# EAGLE design LMeterShield_Rev1 (EAGLE 7.1.0)
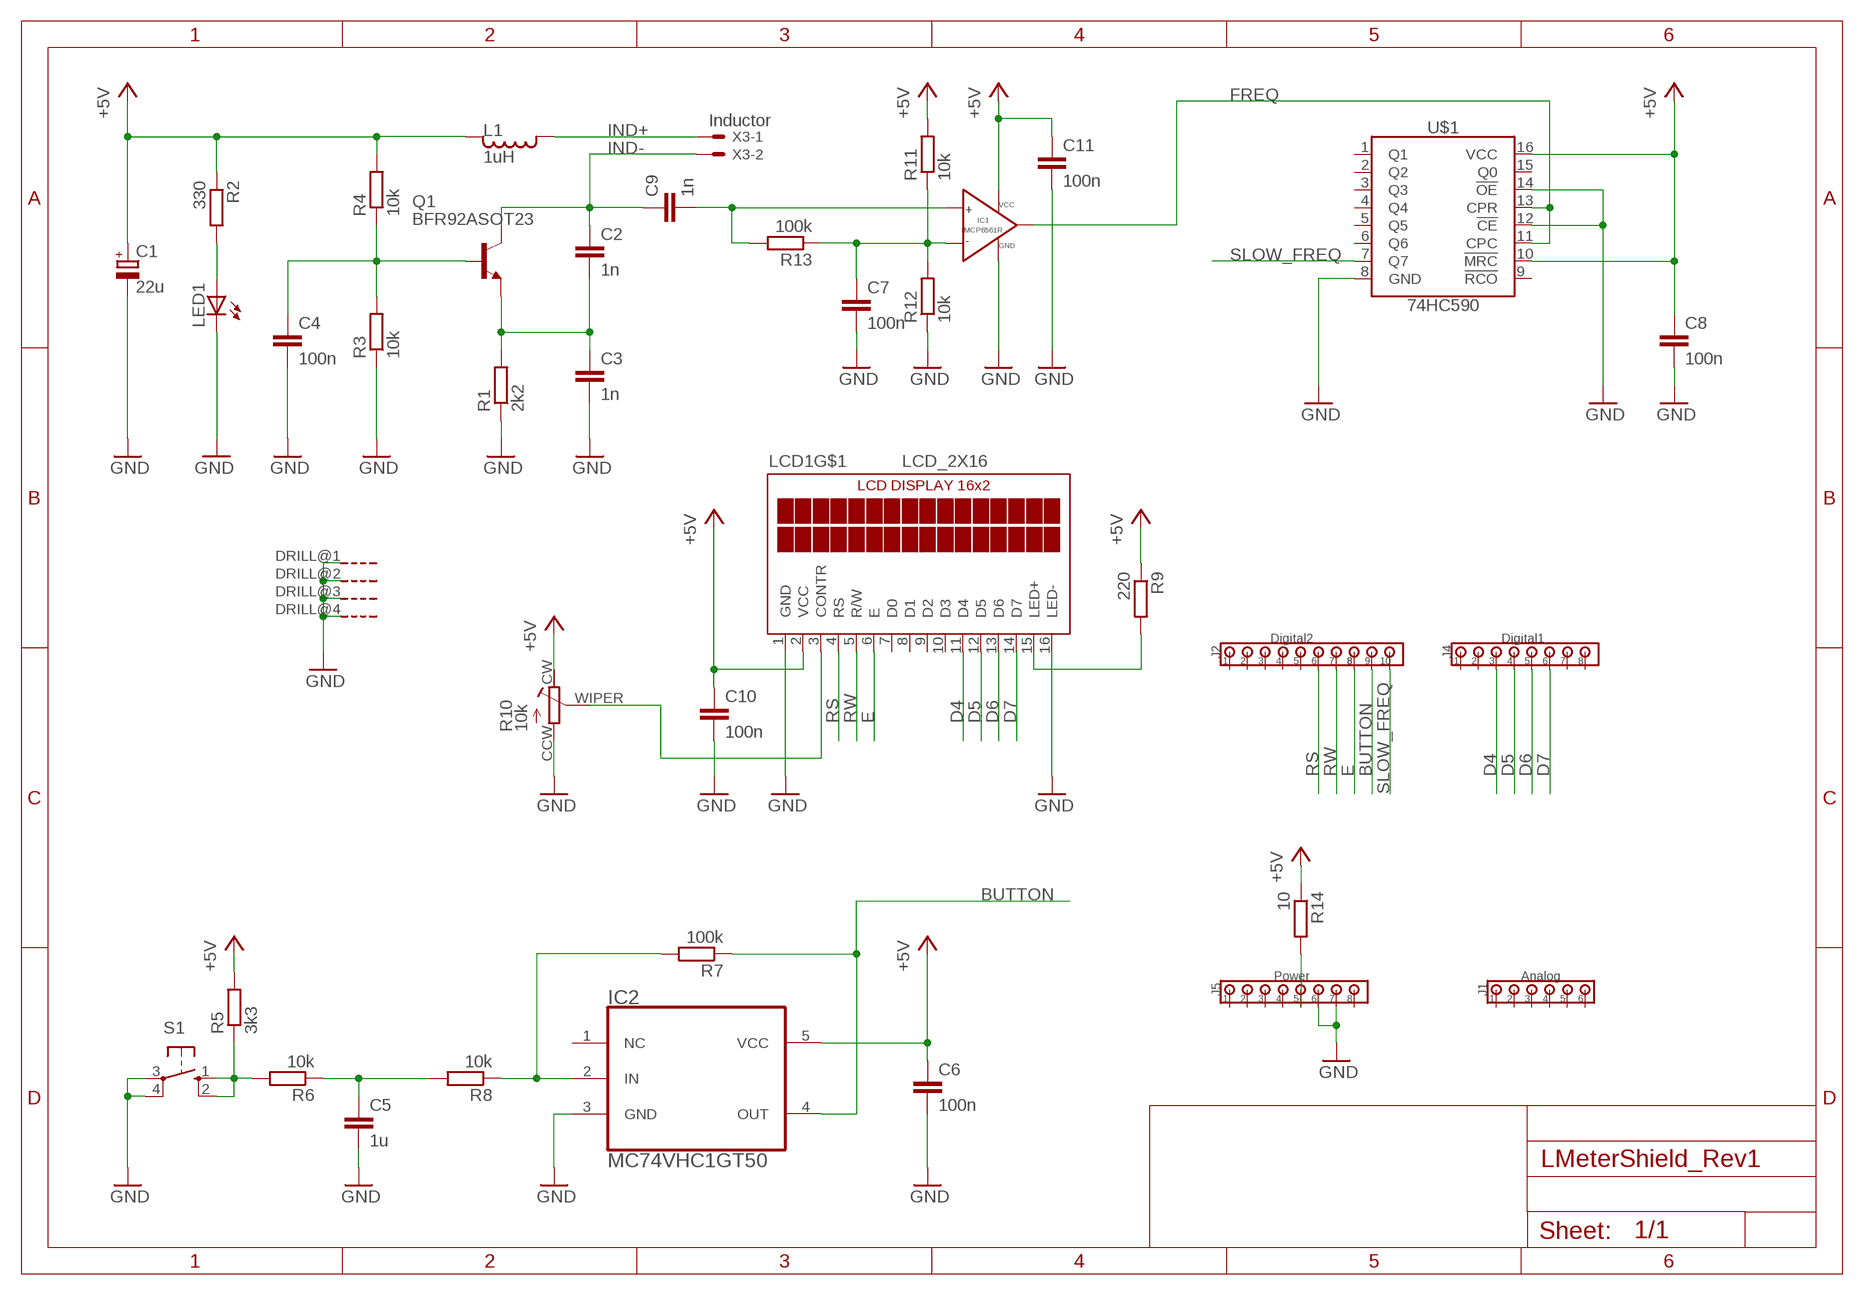
[diagram p0: schematic, sheet 1]

## Parts
C1  22u  C_POLARIZEDSMC_C  [SMC_C]
C2  1n  CC0805  [C0805]
C3  1n  CC0805  [C0805]
C4  100n  CC0805  [C0805]
C5  1u  CC0805  [C0805]
C6  100n  CC0805  [C0805]
C7  100n  CC0805  [C0805]
C8  100n  CC0805  [C0805]
C9  1n  CC0805  [C0805]
C10  100n  CC0805  [C0805]
C11  100n  CC0805  [C0805]
IC1  MCP6561R  [SOT-23-5]
IC2  MC74VHC1GT50  [SOT-23-5]
J1  Analog  100MIL_6X  [100MIL_6X_ROUND]
J2  Digital2  100MIL_10X  [100MIL_10X_ROUND]
J4  Digital1  100MIL_8X  [100MIL_8X_ROUND]
J5  Power  100MIL_8X  [100MIL_8X_ROUND]
L1  1uH  INDUCTOR0805  [L0805]
LCD1  LCD_2X16  [LCD_2X16]
LED1  LED0805  [LED0805]
Q1  BFR92ASOT23  [SOT23]
R1  2k2  RESISTORR0805  [R0805]
R2  330  RESISTORR0805  [R0805]
R3  10k  RESISTORR0805  [R0805]
R4  10k  RESISTORR0805  [R0805]
R5  3k3  RESISTORR0805  [R0805]
R6  10k  RESISTORR0805  [R0805]
R7  100k  RESISTORR0805  [R0805]
R8  10k  RESISTORR0805  [R0805]
R9  220  RESISTORR0805  [R0805]
R10  10k  TRIMMER3314G  [RTRIM3314G]
R11  10k  RESISTORR0805  [R0805]
R12  10k  RESISTORR0805  [R0805]
R13  100k  RESISTORR0805  [R0805]
R14  10  RESISTORR0805  [R0805]
S1  10-XX  [B3F-10XX]
U$1  74HC590  [SO16]
X3  Inductor  22-23-2021100MIL  [22-23-2021]

## Nets
+5V: C1.+ C6.1 C8.1 C10.1 C11.1 IC1.2(VCC) IC2.5(VCC) L1.2 LCD1.2(VCC) R2.1 R4.2 R5.2 R9.1 R10.CW R11.2 R14.1 U$1.10(!MRC!) U$1.16(VCC)
BUTTON: IC2.4(OUT) J2.9 R7.1
D4: J4.3 LCD1.11(D4)
D5: J4.4 LCD1.12(D5)
D6: J4.5 LCD1.13(D6)
D7: J4.6 LCD1.14(D7)
E: J2.8 LCD1.6(E)
FREQ: IC1.1(VOUT) U$1.11(CPC) U$1.13(CPR)
GND: C1.- C3.2 C4.2 C5.2 C6.2 C7.2 C8.2 C10.2 C11.2 IC1.5(GND) IC2.3(GND) J5.6 J5.7 LCD1.1(GND) LCD1.16(LED-) LCD1.DRILL@1(G) LCD1.DRILL@2(G) LCD1.DRILL@3(G) LCD1.DRILL@4(G) LED1.C R1.1 R3.1 R10.CCW R12.1 S1.3(P) S1.4(P1) U$1.8(GND) U$1.12(!CE!) U$1.14(!OE!)
IND+: L1.1 X3.1
IND-: C2.1 C9.1 Q1.3(C) X3.2
N$1: LED1.A R2.2
N$3: C2.2 C3.1 Q1.2(E) R1.2
N$4: C4.1 Q1.1(B) R3.2 R4.1
N$6: C5.1 R6.1 R8.2
N$7: R5.1 R6.2 S1.1(S) S1.2(S1)
N$8: IC2.2(IN) R7.2 R8.1
N$9: LCD1.15(LED+) R9.2
N$10: LCD1.3(CONTR) R10.WIPER
N$11: C7.1 IC1.4(VIN-) R11.1 R12.2 R13.1
N$12: C9.2 IC1.3(VIN+) R13.2
RS: J2.6 LCD1.4(RS)
RW: J2.7 LCD1.5(R/W)
SLOW_FREQ: J2.10 U$1.7(Q7)
VIN: J5.5 R14.2
Unconnected: IC2.1(NC) J1.1 J1.2 J1.3 J1.4 J1.5 J1.6 J2.1 J2.2 J2.3 J2.4 J2.5 J4.1 J4.2 J4.7 J4.8 J5.1 J5.2 J5.3 J5.4 J5.8 LCD1.7(D0) LCD1.8(D1) LCD1.9(D2) LCD1.10(D3) U$1.1(Q1) U$1.2(Q2) U$1.3(Q3) U$1.4(Q4) U$1.5(Q5) U$1.6(Q6) U$1.9(!RCO!) U$1.15(Q0)

## Library data of the parts
C1 = 00Capacitor:C_POLARIZED
C2-C11 = 00Capacitor:C: Capacitor
IC1 = 00OpAmp:MCP6561R: 1.8V Low-Power Push-Pull Output Comparator Propagation delay 80ns max
IC2 = 00Logic:MC74VHC1GT50: Non-Inverting Buffer / Level Shifter
J1 = 00Connector:100MIL_6X: 100 mil 6-pin connector
J2 = 00Connector:100MIL_10X: 100mil 10-pin connector
J4 J5 = 00Connector:100MIL_8X: 100 mil 8-pin connector
L1 = 00Inductor:INDUCTOR
LCD1 = 00Display:LCD_2X16
LED1 = 00Display:LED: LED
Q1 = 00Transistor:BFR92A
R1-R9 R11-R14 = 00Resistor:RESISTOR: RESISTOR, European symbol
R10 = 00Resistor:TRIMMER
S1 = 00Switch:10-XX: OMRON SWITCH
U$1 = 00Logic:74HC590: 8-bit binary counter with output register; 3-state
X3 = 00Connector:22-23-2021: .100" (2.54mm) Center Header - 2 Pin; MF: MOLEX; MPN: 22-23-2021; OC_FARNELL: 1462926; OC_NEWARK: 25C3832

## Board
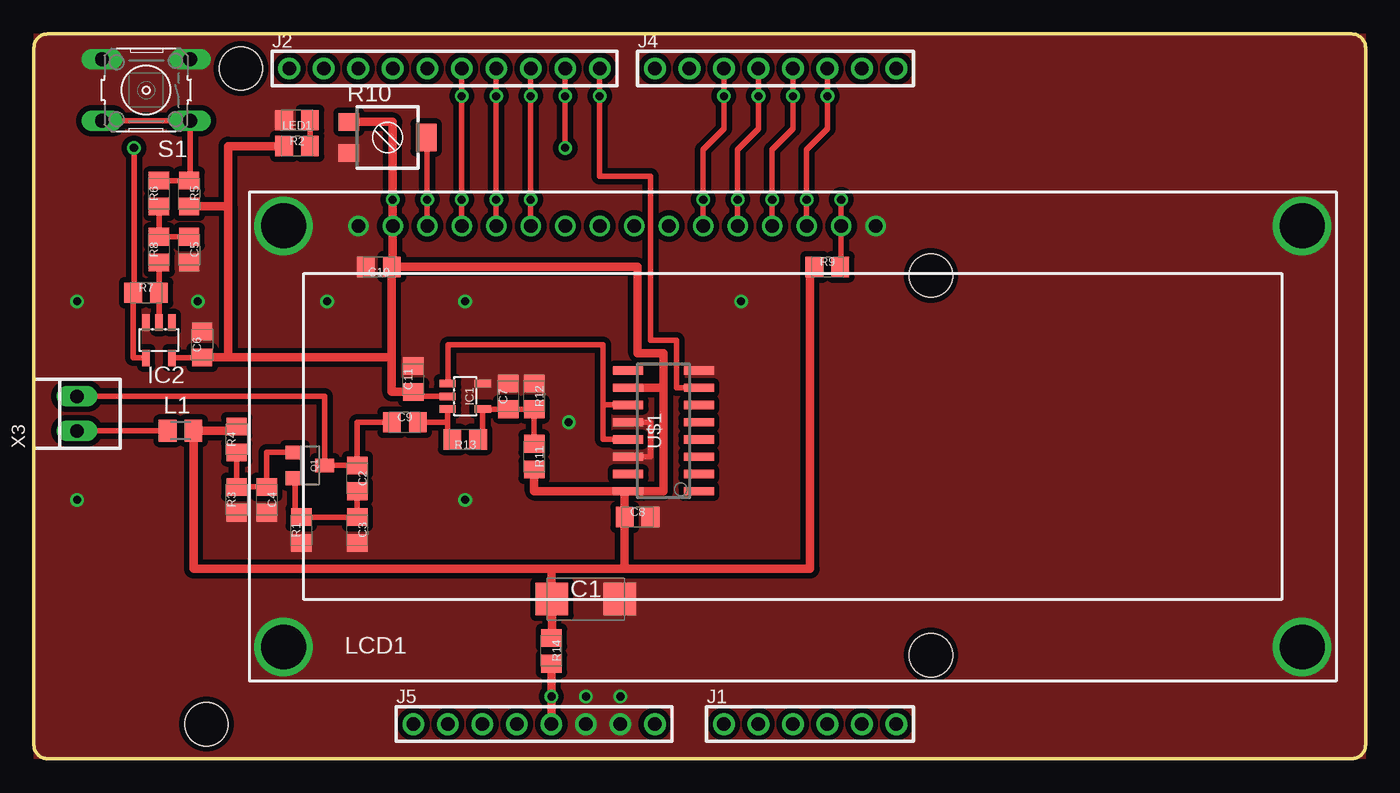
[diagram p1: board, top side]
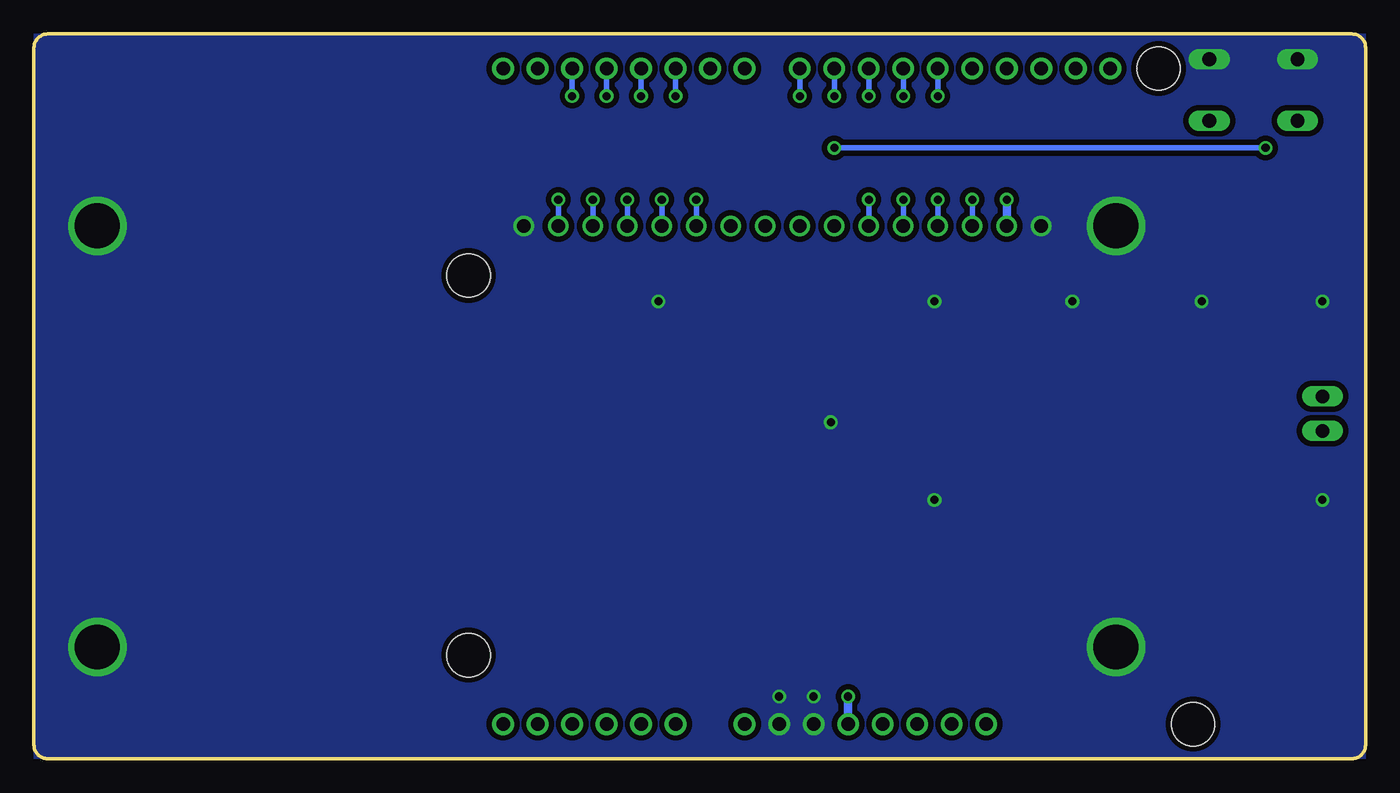
[diagram p2: board, bottom side, seen from below]

Size 98.04 x 53.34 mm. Coordinates in mm from the lower left corner, seen from the top.
Outline: 65.04,0 97.03,0 arc90 98.04,1.02 98.04,52.32 arc90 97.03,53.34 1,53.34 arc90 0,52.34 0,1 arc90 1,0 65.02,0
Outline: 65.02,0 arc-90 65.04,0
Outline: 65.04,0 65.02,0
Copper layers (1*16): Top 0.035mm / dielectric 1.5mm / Bottom 0.035mm
Design rules "default *": minimum track width 10mil, minimum drill 24mil, track to track 8mil, track to pad 8mil, pad to pad 8mil, via to via 8mil, smd to smd 8mil, copper to edge 0mil, drill to drill 8mil, minimum pad ring 10mil, minimum via ring 8mil, stop-mask expansion 4mil, vias tented up to drill 0mil, thermal gap 10mil
Holes 3.2 mm at 15.24,50.8 66.04,7.62 66.04,35.56 12.7,2.54

### Footprints (pad centres in the part's own frame; a part is rotated, then mirrored left to right if it is on the bottom)
SMC_C = smd 2.4 x 2.4: + -2.5,0; - 2.5,0
C0805 = smd 1.3 x 1.5: 1 -0.95,0; 2 0.95,0
SOT-23-5 = smd 0.55 x 1.2: 1 -0.95,-1.3; 2 0,-1.3; 3 0.95,-1.3; 4 0.95,1.3; 5 -0.95,1.3
100MIL_6X_ROUND = drill 1 pad 1.6: 1 -6.35,0; 2 -3.81,0; 3 -1.27,0; 4 1.27,0; 5 3.81,0; 6 6.35,0
100MIL_10X_ROUND = drill 1 pad 1.6: 1 -8.89,0; 2 -6.35,0; 3 -3.81,0; 4 -1.27,0; 5 1.27,0; 6 3.81,0; 7 6.35,0; 8 8.89,0; 9 11.43,0; 10 13.97,0
100MIL_8X_ROUND = drill 1 pad 1.6: 1 -8.89,0; 2 -6.35,0; 3 -3.81,0; 4 -1.27,0; 5 1.27,0; 6 3.81,0; 7 6.35,0; 8 8.89,0
L0805 = smd 1.3 x 1.6: 1 -0.95,0; 2 0.95,0
LCD_2X16 = drill 1: 1 8,33.5; 2 10.54,33.5; 3 13.08,33.5; 4 15.62,33.5; 5 18.16,33.5; 6 20.7,33.5; 7 23.24,33.5; 8 25.78,33.5; 9 28.32,33.5; 10 30.86,33.5; 11 33.4,33.5; 12 35.94,33.5; 13 38.48,33.5; 14 41.02,33.5; 15 43.56,33.5; 16 46.1,33.5 | drill 3.3: DRILL@1 2.5,33.5; DRILL@2 77.5,33.5; DRILL@3 77.5,2.5; DRILL@4 2.5,2.5
LED0805 = smd 1.3 x 1.5: A -0.95,0; C 0.95,0
SOT23 = smd 1 x 1.4: 1 -0.95,-1.1; 2 0.95,-1.1; 3 0,1.1
R0805 = smd 1.3 x 1.5: 1 -0.95,0; 2 0.95,0
RTRIM3314G = smd 1.3 x 1.5: CCW 1.15,-2.85; CW -1.15,-2.85 | smd 2 x 1.5: WIPER 0,2.85
B3F-10XX = drill 1.016 long: 1 -3.251,2.261; 2 3.251,2.261; 3 -3.251,-2.261; 4 3.251,-2.261
SO16 = smd 0.6 x 2.2: 1 -4.445,-2.6; 2 -3.175,-2.6; 3 -1.905,-2.6; 4 -0.635,-2.6; 5 0.635,-2.6; 6 1.905,-2.6; 7 3.175,-2.6; 8 4.445,-2.6; 9 4.445,2.6; 10 3.175,2.6; 11 1.905,2.6; 12 0.635,2.6; 13 -0.635,2.6; 14 -1.905,2.6; 15 -3.175,2.6; 16 -4.445,2.6
22-23-2021 = drill 1 long: 1 -1.27,0; 2 1.27,0

### Placement (x,y rotation side)
C1  40.64,11.75 0 top
C2  23.81,20.64 270 top
C3  23.81,16.83 270 top
C4  17.14,19.05 270 top
C5  11.43,37.47 270 top
C6  12.38,30.48 90 top
C7  34.92,26.67 90 top
C8  44.45,17.78 0 top
C9  27.3,24.77 0 top
C10  25.4,36.2 180 top
C11  27.94,27.94 90 top
IC1  31.75,26.67 270 top
IC2  9.21,30.8 180 top
J1  57.15,2.54 0 top
J2  27.69,50.8 0 top
J4  54.61,50.8 0 top
J5  36.83,2.54 0 top
L1  10.79,24.13 0 top
LCD1  15.88,5.71 0 top
LED1  19.37,46.99 180 top
Q1  20.32,21.59 270 top
R1  19.68,16.83 90 top
R2  19.37,45.09 0 top
R3  14.92,19.05 90 top
R4  14.92,23.5 90 top
R5  11.43,41.59 270 top
R6  9.21,41.59 90 top
R7  8.26,34.29 0 top
R8  9.21,37.47 90 top
R9  58.42,36.2 0 top
R10  26.04,45.72 270 top
R11  36.83,22.23 270 top
R12  36.83,26.67 270 top
R13  31.75,23.5 180 top
R14  38.1,7.94 270 top
S1  8.26,49.21 180 top
U$1  46.35,24.13 90 top
X3  3.17,25.4 90 top

### Tracks (layer width: path | path; a pad name or v marks a point on that pad's centre or on a via)
+5V  (via drill 0.6)
  Top 0.406: IC1.2 28.26,26.67 arc-90 C11.1 | IC2.5 12.03,29.5 C6.1
  Top 0.61: U$1.10 46.35,27.3 | 46.35,27.3 46.35,19.68 U$1.16 | U$1.16 36.83,19.68 R11.2 | R10.CW 26.41,46.87 LCD1.2 26.41,36.2 C10.1 | 43.5,13.97 C8.1 43.5,19.68 U$1.16 | R9.1 57.15,36.2 57.15,13.97 43.5,13.97 | 26.35,29.53 26.35,26.99 C11.1 | 26.35,29.53 C10.1 | R4.2 14.92,24.13 L1.2 11.74,13.97 38.1,13.97 | 38.1,13.97 43.5,13.97 | 46.35,27.3 46.35,29.84 44.45,29.84 44.45,36.2 C10.1 | 12.03,29.5 12.03,29.53 14.29,29.53 | 14.29,29.53 26.35,29.53 | R5.2 14.29,40.64 | 14.29,40.64 14.29,29.53 | R2.1 14.29,45.09 14.29,40.64 | R14.1 38.14,8.57 C1.+ 38.1,11.43 38.1,13.97
  Bottom 0.406: 26.42,39.12 LCD1.2
  Bottom 0.61: v26.42,41.15 26.42,39.12
BUTTON  (via drill 0.6)
  Top 0.406: J2.9 v39.12,48.77 v39.12,44.96 | IC2.4 7.3,29.5 R7.1 7.37,34.8 v7.37,44.96
  Bottom 0.406: v39.12,48.77 J2.9 | v39.12,44.96 v7.37,44.96
D4  (via drill 0.6)
  Top 0.406: J4.3 v50.8,48.77 50.8,46.35 49.27,44.83 LCD1.11
  Bottom 0.406: J4.3 v50.8,48.77 | v49.28,41.15 49.28,39.12 49.27,39.12 LCD1.11
D5  (via drill 0.6)
  Top 0.406: J4.4 v53.34,48.77 53.34,46.35 51.81,44.83 LCD1.12
  Bottom 0.406: v53.34,48.77 J4.4 | v51.82,41.15 51.82,39.12 51.81,39.12 LCD1.12
D6  (via drill 0.6)
  Top 0.406: J4.5 v55.88,48.77 55.88,46.35 54.35,44.83 LCD1.13
  Bottom 0.406: J4.5 v55.88,48.77 | v54.36,41.15 54.36,39.37 | 54.36,39.37 54.36,39.12 | LCD1.13 54.35,39.37 54.36,39.37
D7  (via drill 0.6)
  Top 0.406: J4.6 v58.42,48.77 58.42,46.35 56.9,44.83 LCD1.14
  Bottom 0.406: v58.42,48.77 J4.6 | v56.9,41.15 56.9,39.12 LCD1.14
E  (via drill 0.6)
  Top 0.406: J2.8 arc90 J2.8 LCD1.6
  Bottom 0.406: v36.58,48.77 J2.8 | v36.58,41.15 36.58,39.12 LCD1.6
FREQ
  Top 0.406: U$1.13 41.91,23.5 41.91,26.04 | 41.91,26.04 U$1.11 | IC1.1 30.48,27.62 30.48,30.48 41.91,30.48 41.91,26.04
GND  (via drill 0.6)
  Top 0.406: U$1.12 45.4,24.77 45.4,22.23 43.81,22.23
  other vias: 39.37,24.77 52.07,33.66 31.75,33.66 31.75,19.05 40.64,4.57 43.18,4.57 12.06,33.66 3.17,33.66 21.59,33.66 3.17,19.05
  pour Top (isolate 0.4, no thermals): 0,53.34 98.04,53.34 98.04,0 0,0
  pour Bottom (isolate 0.4, no thermals): 0,53.34 98.04,53.34 98.04,0 0,0
IND+
  Top 0.406: X3.1 L1.1
IND-
  Top 0.406: X3.2 21.42,26.67 Q1.3 C2.1 23.81,24.77 C9.1
N$1
  Top 0.406: R2.2 LED1.A
N$3
  Top 0.406: Q1.2 19.22,17.78 R1.2 C3.1 C2.2
N$4
  Top 0.406: R4.1 R3.2 C4.1 17.14,22.54 Q1.1
N$6
  Top 0.406: R6.1 R8.2 C5.1
N$7
  Top 0.406: R6.2 R5.1 11.51,42.54 S1.1 S1.2
N$8
  Top 0.406: IC2.2 R7.2 R8.1
N$9  (via drill 0.6)
  Top 0.406: LCD1.15 | LCD1.15 v59.44,41.15 | LCD1.15 59.44,36.26 R9.2
  Bottom 0.406: LCD1.15 v59.44,41.15
N$10  (via drill 0.6)
  Top 0.406: LCD1.3 28.95,45.65 R10.WIPER
  Bottom 0.406: v28.96,41.15 28.96,39.12 28.95,39.12 LCD1.3
N$11
  Top 0.406: R11.1 R12.2 C7.1 IC1.4 33.05,23.5 R13.1
N$12
  Top 0.406: R13.2 30.45,23.5 IC1.3 30.45,24.77 C9.2
RS  (via drill 0.6)
  Top 0.406: J2.6 arc90 J2.6 LCD1.4
  Bottom 0.406: v31.5,48.77 J2.6 | v31.5,41.15 31.5,39.12 LCD1.4
RW  (via drill 0.6)
  Top 0.406: J2.7 arc90 J2.7 LCD1.5
  Bottom 0.406: v34.04,48.77 J2.7 | v34.04,41.15 LCD1.5 | 34.04,39.12 LCD1.5 | LCD1.5
SLOW_FREQ  (via drill 0.6)
  Top 0.406: U$1.7 47.31,27.3 47.31,30.8 45.4,30.8 45.4,42.86 41.66,42.86 v41.66,48.77 J2.10
  Bottom 0.406: v41.66,48.77 J2.10
VIN  (via drill 0.6)
  Top 0.61: J5.5 v38.1,4.57 R14.2
  Bottom 0.61: J5.5 38.1,4.45

### Text on the board
tText: Lukas Fässler | Inductance Meter